# Altium schematic sheet BMS Design 1 New Part Monitor.SchDoc
size C; SheetNumber: 2; SheetTotal: 2; SPICEModelCacheHQQCTOEM: <root> / <DocumentId>HQQCTOEM</DocumentId> / <CacheFrame Number="0"> / <Model Name="cap" Kind="MDL"> / <Text>*Default semiconductor capacitor / .MODEL CAP C()</Text> / </Model> / </CacheFrame> / </root>
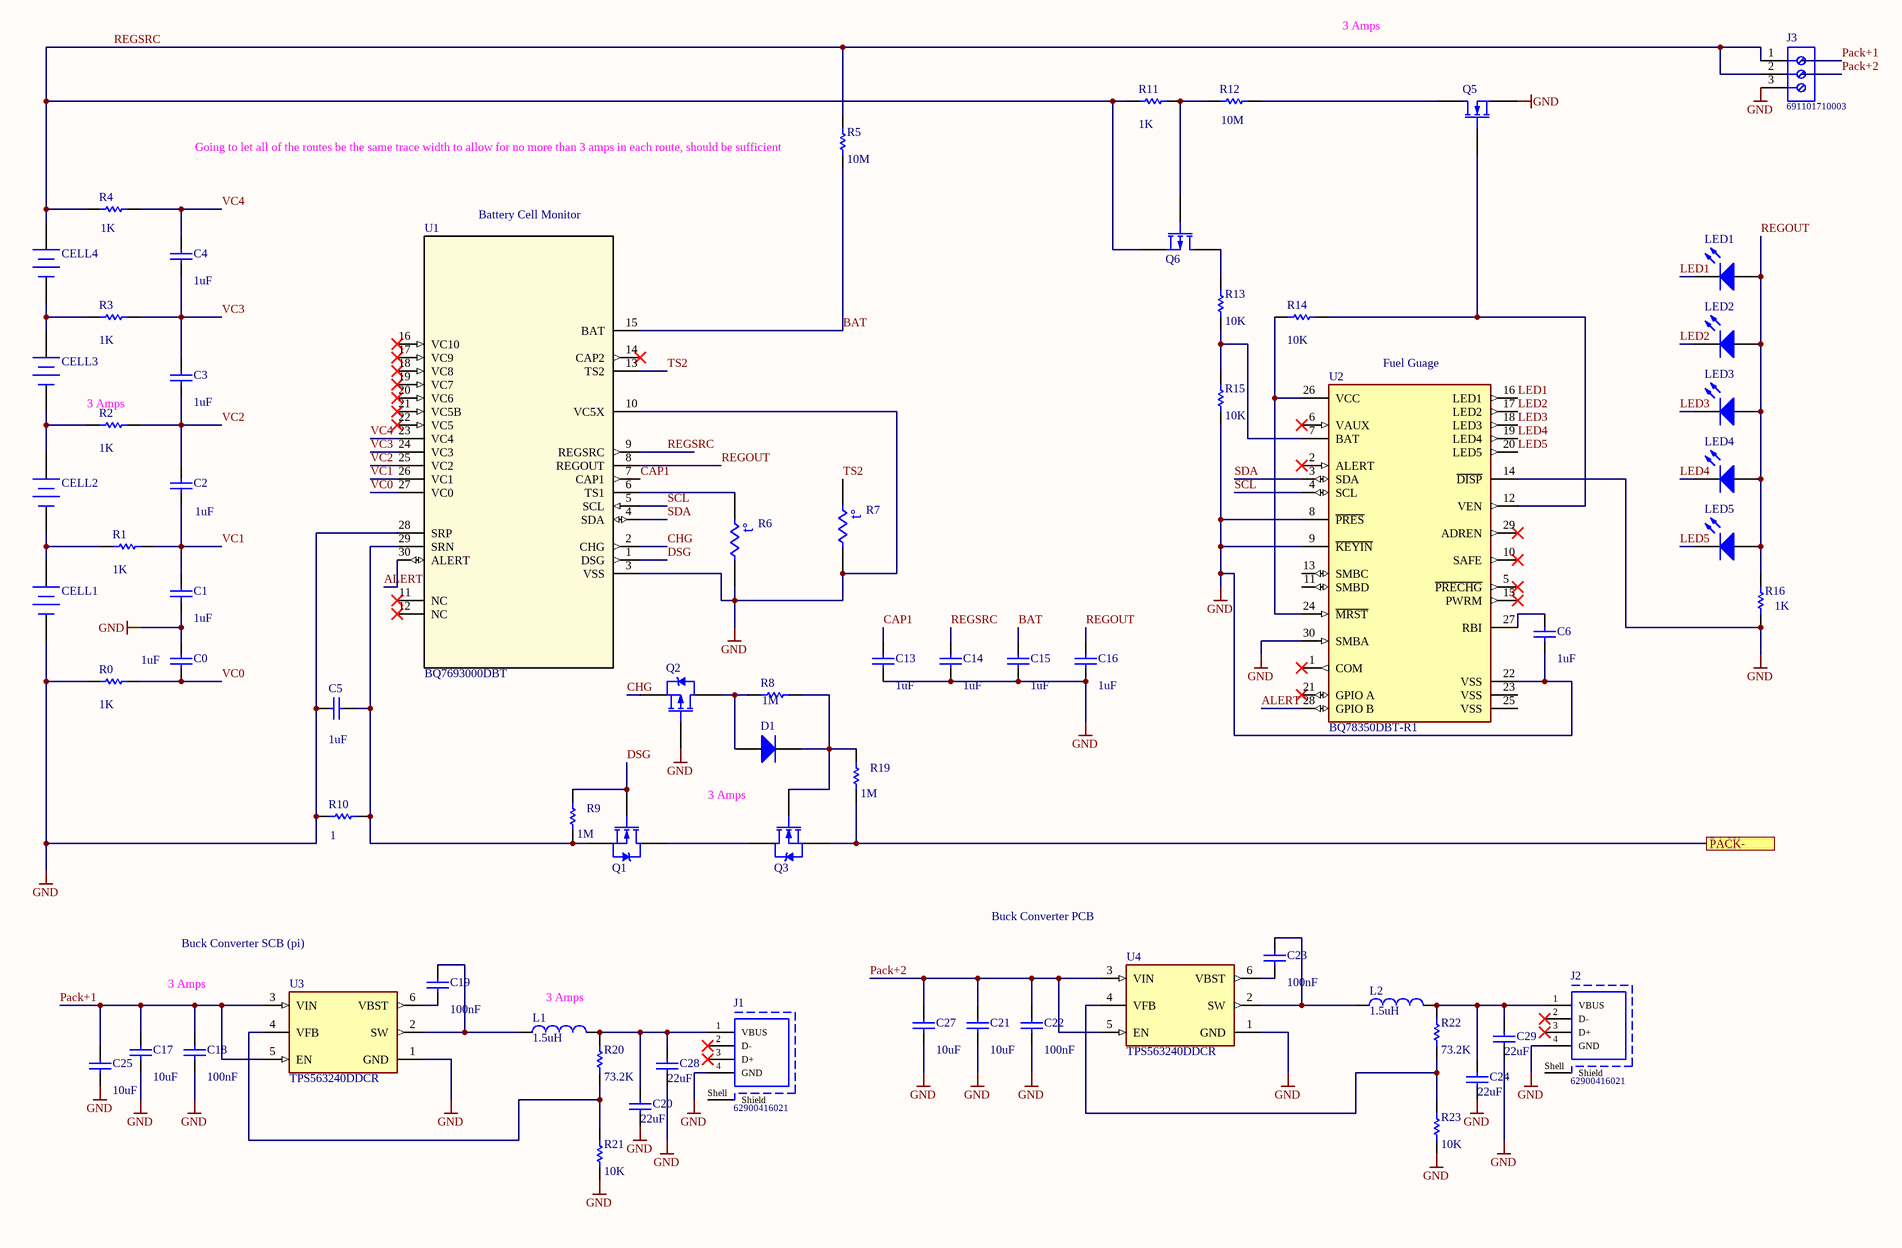
[diagram p0: BMS Design 1 New Part Monitor.SchDoc]

## Parts
C0  value 1uF  [RAD-0.3]
C1  value 1uF  [RAD-0.3]
C2  value 1uF  [RAD-0.3]
C3  value 1uF  [RAD-0.3]
C4  value 1uF  [RAD-0.3]
C5  value 1uF  [RAD-0.3]
C6  value 1uF  [RAD-0.3]
C13  value 1uF  [RAD-0.3]
C14  value 1uF  [RAD-0.3]
C15  value 1uF  [RAD-0.3]
C16  value 1uF  [RAD-0.3]
C17  value 10uF  [RAD-0.3]
C18  value 100nF  [RAD-0.3]
C19  value 100nF  [RAD-0.3]
C20  value 22uF  [RAD-0.3]
C21  value 10uF  [RAD-0.3]
C22  value 100nF  [RAD-0.3]
C23  value 100nF  [RAD-0.3]
C24  value 22uF  [RAD-0.3]
C25  value 10uF  [RAD-0.3]
C27  value 10uF  [RAD-0.3]
C28  value 22uF  [RAD-0.3]
C29  value 22uF  [RAD-0.3]
CELL1  (no value)  [BAT-2]
CELL2  (no value)  [BAT-2]
CELL3  (no value)  [BAT-2]
CELL4  (no value)  [BAT-2]
D1  (no value)  [SMC]
J1  62900416021  [62900416021]
J2  62900416021  [62900416021]
J3  691101710003  [691101710003]
L1  value 1.5uH  [0402-A]
L2  value 1.5uH  [0402-A]
LED1  (no value)  [LED-0]
LED2  (no value)  [LED-0]
LED3  (no value)  [LED-0]
LED4  (no value)  [LED-0]
LED5  (no value)  [LED-0]
Q1  (no value)  [TO-220AB]
Q2  (no value)  [TO-220AB]
Q3  (no value)  [TO-220AB]
Q5  (no value)  [E3]
Q6  (no value)  [E3]
R0  value 1K  [AXIAL-0.3]
R1  value 1K  [AXIAL-0.3]
R2  value 1K  [AXIAL-0.3]
R3  value 1K  [AXIAL-0.3]
R4  value 1K  [AXIAL-0.3]
R5  value 10M  [AXIAL-0.3]
R6  (no value)  [6-0805_N]
R7  (no value)  [6-0805_N]
R8  value 1M  [AXIAL-0.3]
R9  value 1M  [AXIAL-0.3]
R10  R10: 1  [AXIAL-0.3]
R11  value 1K  [AXIAL-0.3]
R12  value 10M  [AXIAL-0.3]
R13  value 10K  [AXIAL-0.3]
R14  value 10K  [AXIAL-0.3]
R15  value 10K  [AXIAL-0.3]
R16  value 1K  [AXIAL-0.3]
R19  value 1M  [AXIAL-0.3]
R20  value 73.2K  [AXIAL-0.3]
R21  value 10K  [AXIAL-0.3]
R22  value 73.2K  [AXIAL-0.3]
R23  value 10K  [AXIAL-0.3]
U1  BQ7693000DBT  [DBT0030A_N]
U2  BQ78350DBT-R1  [FP-DBT0030A-IPC_C]
U3  TPS563240DDCR  [FP-DDC0006A-MFG]
U4  TPS563240DDCR  [FP-DDC0006A-MFG]

## Ports
PACK-

## Nets
GND: C0.2 C1.1 C5.1 C6.1 C13.1 C14.1 C15.1 C16.1 C17.1 C18.1 C20.1 C21.1 C22.1 C24.1 C25.1 C27.1 C28.1 C29.1 CELL1.2(-) J1.4(GND) J2.4(GND) J3.3 Q2.1(G) Q5.3(S) R0.1 R6.2 R7.2 R10.1 R15.1 R16.1 R21.1 R23.1 U1.3(VSS) U1.10(VC5X) U1.28(SRP) U2.8(~{PRES}) U2.9(~{KEYIN}) U2.14(~{DISP}) U2.22(VSS) U2.30(SMBA) U3.1(GND) U4.1(GND)
ALERT: U1.30(ALERT) U2.28(GPIO_B)
BAT: C15.2 R5.1 U1.15(BAT)
CAP1: C13.2 U1.7(CAP1)
CHG: Q2.3(S) U1.2(CHG)
DSG: Q1.1(G) R9.2 U1.1(DSG)
LED1: LED1.2(K) U2.16(LED1)
LED2: LED2.2(K) U2.17(LED2)
LED3: LED3.2(K) U2.18(LED3)
LED4: LED4.2(K) U2.19(LED4)
LED5: LED5.2(K) U2.20(LED5)
Pack+1: C17.2 C18.2 C25.2 U3.3(VIN) U3.5(EN)
Pack+2: C21.2 C22.2 C27.2 U4.3(VIN) U4.5(EN)
PACK-: Q3.3(S) R19.1 ; port PACK-
REGOUT: C16.2 LED1.1(A) LED2.1(A) LED3.1(A) LED4.1(A) LED5.1(A) R16.2 U1.8(REGOUT)
REGSRC: C14.2 CELL4.1(+) J3.1 J3.2 Q6.3(S) R4.1 R5.2 R11.1 U1.9(REGSRC)
SCL: U1.5(SCL) U2.4(SCL)
SDA: U1.4(SDA) U2.3(SDA)
TS2: R7.1 U1.13(TS2)
VC0: C0.1 R0.2 U1.27(VC0)
VC1: C1.2 C2.1 R1.2 U1.26(VC1)
VC2: C2.2 C3.1 R2.2 U1.25(VC2)
VC3: C3.2 C4.1 R3.2 U1.24(VC3)
VC4: C4.2 R4.2 U1.23(VC4)
NetC5_2: C5.2 Q1.3(S) R9.1 R10.2 U1.29(SRN)
NetC6_2: C6.2 U2.27(RBI)
NetC19_1: C19.1 U3.6(VBST)
NetC19_2: C19.2 L1.1 U3.2(SW)
NetC20_2: C20.2 C28.2 J1.1(VBUS) L1.2 R20.2
NetC23_1: C23.1 U4.6(VBST)
NetC23_2: C23.2 L2.1 U4.2(SW)
NetC24_2: C24.2 C29.2 J2.1(VBUS) L2.2 R22.2
NetCELL1_1: CELL1.1(+) CELL2.2(-) R1.1
NetCELL2_1: CELL2.1(+) CELL3.2(-) R2.1
NetCELL3_1: CELL3.1(+) CELL4.2(-) R3.1
NetD1_1: D1.1(A) Q2.2(D) R8.2
NetD1_2: D1.2(K) Q3.1(G) R8.1 R19.2
NetQ1_2: Q1.2(D) Q3.2(D)
NetQ5_1: Q5.1(D) R12.2
NetQ5_2: Q5.2(G) R14.2 U2.12(VEN)
NetQ6_1: Q6.1(D) R13.2
NetQ6_2: Q6.2(G) R11.2 R12.1
NetR6_1: R6.1 U1.6(TS1)
NetR13_1: R13.1 R15.2 U2.7(BAT)
NetR14_1: R14.1 U2.24(~{MRST}) U2.26(VCC)
NetR20_1: R20.1 R21.2 U3.4(VFB)
NetR22_1: R22.1 R23.2 U4.4(VFB)

Not connected (* = marked no-connect by the designer): J1 2(D-)* 3(D+)* Shell(Shield); J2 2(D-)* 3(D+)* Shell(Shield); U1 11(NC)* 12(NC)* 14(CAP2)* 16(VC10)* 17(VC9)* 18(VC8)* 19(VC7)* 20(VC6)* 21(VC5B)* 22(VC5)*; U2 1(COM)* 2(ALERT)* 5(~{PRECHG})* 6(VAUX)* 10(SAFE)* 11(SMBD) 13(SMBC) 15(PWRM)* 21(GPIO_A)* 23(VSS) 25(VSS) 29(ADREN)*

## Notes on the sheet
- 3 Amps
- (near R5) Going to let all of the routes be the same trace width to allow for no more than 3 amps in each route, should be sufficient
- Battery Cell Monitor
- (near U2) Fuel Guage
- (near R2) 3 Amps
- Buck Converter PCB
- Buck Converter SCB (pi)
- (in symbol Res Thermal) t°

## Library data of the parts
C0-C6 C13-C25 C27-C29 = Cap: Capacitor; Published: 8-Jun-2000; LatestRevisionDate: 17-Jul-2002; LatestRevisionNote: Re-released for DXP Platform.; PackageReference: RAD-0.3; Publisher: Altium Limited; PackageDescription: Radial Cap, Thru-Hole; 2 Leads; 0.3 in Pin Spacing
CELL1-CELL4 = Battery: Multicell Battery; Published: 24-Mar-1999; LatestRevisionDate: 17-Jul-2002; LatestRevisionNote: Re-released for DXP Platform.; PackageReference: BAT-2; Publisher: Altium Limited; PackageDescription: Battery; 2 Leads
D1 = Diode: Default Diode; Published: 8-Jun-2000; LatestRevisionDate: 17-Jul-2002; LatestRevisionNote: Re-released for DXP Platform.; PackageVersion: Sep-1996; PackageReference: SMC; Publisher: Altium Limited; PackageDescription: DO-214-AB/SMC; 2 C-Bend Leads; Body 7.9 x 5.9 mm, inc. leads (LxW); Code_JEDEC: DO-214-AB
J1 J2 = CMP-1502-03240-1: USB 2.0 Type A Receptacle WR-COM, Horizontal, SMT; Manufacturer: Wurth Elektronik; Rated Current: 1.5A; Contact Resistance: 20mOhm; Working Voltage: 30VAC; Operating Temperature: -40to105degC; Packaging: Tray; Package Reference: 62900416021; Gender: Receptacle; Datasheet URL: https://katalog.we-online.de/em/datasheet/62900416021.pdf; Manufacturer URL: http://www.we-online.de; Part Number: 62900416021; Mounting Technology: SMT; Connector Type: USB2.0TypeA; Orientation: Horizontal; Publisher: WurthElektronik
J3 = CMP-1502-03257-1: Series 101 - 5.00 mm Horizontal Entry Modular with Pressure Clamp WR-TBL, 3 pin; Manufacturer: Wurth Elektronik; Pitch: 5.00mm; Pin Number: 3; Publisher: WurthElektronik; Part Number: 691101710003; Operating Temperature: -40to105degC; Package Reference: 691101710003; Packaging: Box; Manufacturer URL: http://www.we-online.de; Datasheet URL: http://katalog.we-online.de/em/datasheet/6911017100xx.pdf; Mounting Technology: THT
L1 L2 = Inductor: Code_IEC: 1005; Published: 8-Jun-2000; LatestRevisionDate: 29-May-2009; LatestRevisionNote: IPC-7351 Footprint Added.; PackageReference: 0402-A; Publisher: Altium Limited; PackageDescription: Chip Inductor; Code_JEITA: 0402
LED1-LED5 = LED0: Typical INFRARED GaAs LED; Published: 8-Jun-2000; LatestRevisionDate: 08-Jul-2005; LatestRevisionNote: Mech Layer 1 removed.; PackageReference: LED-0; Publisher: Altium Limited; PackageDescription: LED; 2 Leads
Q1 Q3 = NMOS-2: N-Channel Power MOSFET; Note: Pin 2 is electrically connected to pin 4.; Published: 8-Jun-2000; LatestRevisionDate: 17-Jul-2002; LatestRevisionNote: Re-released for DXP Platform.; DatasheetVersion: PD-9.814; PackageVersion: Feb-1997; PackageReference: TO-220AB; Publisher: Altium Limited; PackageDescription: TO, Thru-Hole, Vertical, Heatsink Mounted; 3 In-Line Leads; Pitch 2.54 mm; ComponentLink1Description: Manufacturer Link; ComponentLink1URL: http://www.irf.com/
Q2 = PMOS-2: P-Channel Power MOSFET; Note: Pin 4 not drawn and electrically connected to Pin 2.; Published: 8-Jun-2000; LatestRevisionDate: 17-Jul-2002; LatestRevisionNote: Re-released for DXP Platform.; DatasheetVersion: PD-9.390D; PackageVersion: Feb-1997; PackageReference: TO-220AB; Publisher: Altium Limited; PackageDescription: TO, Thru-Hole, Vertical, Heatsink Mounted; 3 In-Line Leads; Pitch 2.54 mm; ComponentLink1Description: Manufacturer Link; ComponentLink1URL: http://www.irf.com/
Q5 = MOSFET-N: N-Channel MOSFET; Published: 8-Jun-2000; LatestRevisionDate: 17-Jul-2002; LatestRevisionNote: Re-released for DXP Platform.; PackageVersion: 1995/1996; PackageReference: E3; Publisher: Altium Limited; PackageDescription: TO, Flat Index; 3 In-Line, Axial Leads; Body Dia. 4.6mm; Lead Dia. 0.5 mm (max)
Q6 = MOSFET-P: P-Channel MOSFET; Published: 8-Jun-2000; LatestRevisionDate: 17-Jul-2002; LatestRevisionNote: Re-released for DXP Platform.; PackageVersion: 1995/1996; PackageReference: E3; Publisher: Altium Limited; PackageDescription: TO, Flat Index; 3 In-Line, Axial Leads; Body Dia. 4.6mm; Lead Dia. 0.5 mm (max)
R0-R5 R8-R16 R19-R23 = Res1: Resistor; Published: 8-Jun-2000; LatestRevisionDate: 17-Jul-2002; LatestRevisionNote: Re-released for DXP Platform.; PackageReference: AXIAL-0.3; Publisher: Altium Limited; PackageDescription: Axial Device, Thru-Hole; 2 Leads; 0.3 in Pin Spacing
R6 R7 = Res Thermal: Thermistor; Published: 24-Mar-1999; LatestRevisionDate: 29-May-2009; LatestRevisionNote: IPC-7351 Footprint Added.; PackageVersion: Mar-2003; PackageReference: 6-0805; Publisher: Altium Limited; PackageDescription: Chip Resistor 0805 Case Size; Code_IPC: RESC2012
U1 = BQ7693000DBT: No Description Available; Mfr_Name: Texas Instruments; Type: DEV; RefDes: RefDes; Copyright: Copyright (C) 2022 Ultra Librarian. All rights reserved.; Manufacturer_Part_Number: BQ7693000DBT
U2 = CMP-04911-000039-1: IC BATTERY MGMT CTRLR 30TSSOP; Max Supply Voltage: 2.6V; Fault Protection: Over Current; Min Supply Voltage: 2.4V; Interface: SMBus; Output Voltage: 5.5V; Mount: Surface Mount; Min Operating Temperature: -40°C; Number of Pins: 30; Contact Plating: Gold; REACH SVHC: No SVHC; Lead Free: Lead Free; Case/Package: TSSOP; Max Operating Temperature: 85°C; Packaging: Rail/Tube; RoHS Compliant: Yes; Parameter 1: *
U3 U4 = CMP-04918-000473-1: IC REG CTRLR